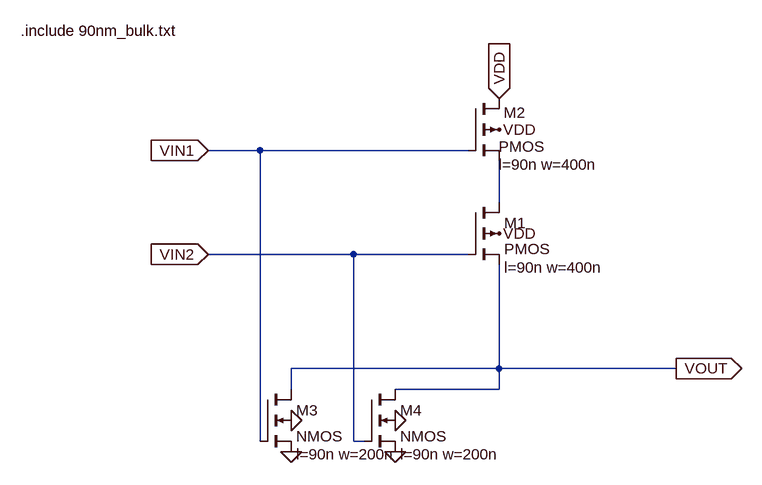
[diagram p0: schematic nor.asc]
nor.asc, the LTspice schematic file:
Version 4
SHEET 1 992 680
WIRE -240 192 -320 192
WIRE 80 192 -240 192
WIRE 128 272 128 208
WIRE -96 352 -320 352
WIRE 80 352 -96 352
WIRE 128 528 128 368
WIRE 128 528 -192 528
WIRE 400 528 128 528
WIRE -192 560 -192 528
WIRE 128 560 128 528
WIRE 128 560 -32 560
WIRE -240 640 -240 192
WIRE -96 640 -96 352
WIRE -80 640 -96 640
FLAG 128 160 VDD
FLAG -192 656 0
FLAG -32 656 0
FLAG -32 608 0
FLAG -192 608 0
FLAG 128 320 VDD
FLAG -320 192 VIN1
IOPIN -320 192 In
FLAG -320 352 VIN2
IOPIN -320 352 In
FLAG 400 528 VOUT
IOPIN 400 528 Out
FLAG 128 112 VDD
IOPIN 128 112 In
SYMBOL pmos4 80 112 R0
WINDOW 0 55 22 Left 2
WINDOW 3 47 74 Left 2
WINDOW 123 47 102 Left 2
SYMATTR InstName M2
SYMATTR Value2 l=90n w=400n
SYMBOL pmos4 80 272 R0
WINDOW 123 56 100 Left 2
SYMATTR Value2 l=90n w=400n
SYMATTR InstName M1
SYMBOL nmos4 -240 560 R0
WINDOW 123 56 100 Left 2
SYMATTR Value2 l=90n w=200n
SYMATTR InstName M3
SYMBOL nmos4 -80 560 R0
WINDOW 123 56 100 Left 2
SYMATTR Value2 l=90n w=200n
SYMATTR InstName M4
TEXT -608 8 Left 2 !.include 90nm_bulk.txt

The netlist it stands for:
* nor.asc
M2 VDD VIN1 N001 VDD PMOS l=90n w=400n
M1 N001 VIN2 VOUT VDD PMOS l=90n w=400n
M3 VOUT VIN1 0 0 NMOS l=90n w=200n
M4 VOUT VIN2 0 0 NMOS l=90n w=200n
.model NMOS NMOS
.model PMOS PMOS
.lib standard.mos
.include 90nm_bulk.txt
.backanno
.end